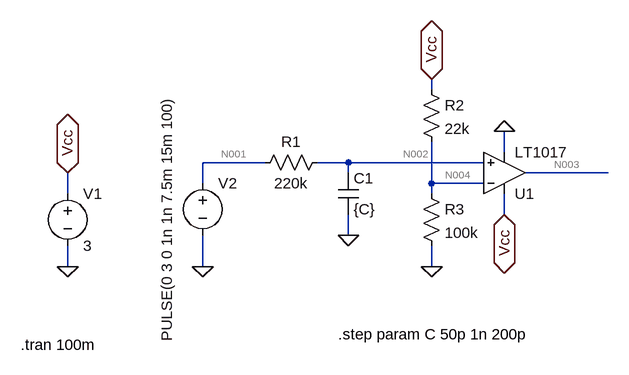
[diagram p0: schematic Draft1.asc]
Draft1.asc, the LTspice schematic file:
Version 4
SHEET 1 880 680
WIRE 352 64 352 48
WIRE 464 160 464 128
WIRE 96 176 0 176
WIRE 224 176 176 176
WIRE 432 176 224 176
WIRE 224 192 224 176
WIRE 624 192 496 192
WIRE 0 208 0 176
WIRE 352 208 352 144
WIRE 432 208 352 208
WIRE -208 224 -208 192
WIRE 352 224 352 208
WIRE 464 256 464 224
WIRE 224 288 224 256
WIRE -208 336 -208 304
WIRE 0 336 0 288
WIRE 352 336 352 304
FLAG 224 288 0
FLAG 352 336 0
FLAG -208 336 0
FLAG -208 192 Vcc
IOPIN -208 192 BiDir
FLAG 464 256 Vcc
IOPIN 464 256 BiDir
FLAG 464 128 0
FLAG 0 336 0
FLAG 352 48 Vcc
IOPIN 352 48 BiDir
SYMBOL res 192 160 R90
WINDOW 0 0 56 VBottom 2
WINDOW 3 32 56 VTop 2
SYMATTR InstName R1
SYMATTR Value 220k
SYMBOL cap 208 192 R0
SYMATTR InstName C1
SYMATTR Value {C}
SYMBOL res 336 48 R0
SYMATTR InstName R2
SYMATTR Value 22k
SYMBOL res 336 208 R0
SYMATTR InstName R3
SYMATTR Value 100k
SYMBOL voltage -208 208 R0
WINDOW 123 0 0 Left 2
WINDOW 39 0 0 Left 2
SYMATTR InstName V1
SYMATTR Value 3
SYMBOL voltage 0 192 R0
WINDOW 3 -55 -119 VRight 2
WINDOW 123 0 0 Left 2
WINDOW 39 0 0 Left 2
SYMATTR InstName V2
SYMATTR Value PULSE(0 3 0 1n 1n 7.5m 15m 100)
SYMBOL Comparators\\LT1017 464 192 M180
SYMATTR InstName U1
TEXT -280 456 Left 2 !.tran 100m
TEXT 208 440 Left 2 !.step param C 50p 1n 200p

The netlist it stands for:
* Draft1.asc
R1 N002 N001 220k
C1 N002 0 {C}
R2 Vcc N004 22k
R3 N004 0 100k
V1 Vcc 0 3
V2 N001 0 PULSE(0 3 0 1n 1n 7.5m 15m 100)
XU1 N002 N004 Vcc 0 N003 LT1017  ; pins In+ In- V+ V- OUT
.tran 100m
.step param C 50p 1n 200p
.backanno
.end

* Results of the author's LTspice run, read from the files saved beside the schematic
* Operating Point (first step), zero values left out:
*   c = 50 p
*   V(n002) = 660.5 µV
*   V(vcc) = 3 V
*   V(n004) = 2.459 V
*   V(n003) = 48.4 mV
*   I(R3) = 24.59 µA
*   I(R2) = 24.6 µA
*   I(R1) = 3.002 nA
*   I(V2) = 3.002 nA
*   I(V1) = -129.1 µA
*   Ix(u1:1) = -3.002 nA
*   Ix(u1:2) = 6.105 nA
*   Ix(u1:3) = 104.5 µA
*   Ix(u1:4) = -104.5 µA
*   Ix(u1:5) = 2.912 pA
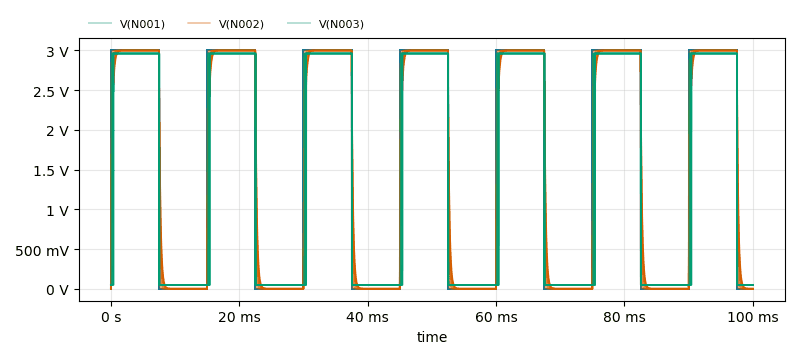
[diagram p1: Transient Analysis of Draft1.asc, plotted from the saved traces]
* Transient Analysis, 6 runs:
*   V(N001) [c=5e-011]: min 0 V, max 3 V, average 1.575 V, rms 2.174 V, last 0 V
*   V(N001) [c=2.5e-010]: min 0 V, max 3 V, average 1.575 V, rms 2.174 V, last 0 V
*   V(N001) [c=4.5e-010]: min 0 V, max 3 V, average 1.575 V, rms 2.174 V, last 0 V
*   V(N001) [c=6.5e-010]: min 0 V, max 3 V, average 1.575 V, rms 2.174 V, last 0 V
*   V(N001) [c=8.5e-010]: min 0 V, max 3 V, average 1.575 V, rms 2.174 V, last 0 V
*   V(N001) [c=1e-009]: min 0 V, max 3 V, average 1.575 V, rms 2.174 V, last 0 V
*   V(N002) [c=5e-011]: min 660.5 µV, max 2.999 V, average 1.575 V, rms 2.171 V, last 660.5 µV
*   V(N002) [c=2.5e-010]: min 660.5 µV, max 2.999 V, average 1.575 V, rms 2.165 V, last 660.5 µV
*   V(N002) [c=4.5e-010]: min 660.5 µV, max 2.999 V, average 1.574 V, rms 2.158 V, last 660.5 µV
*   V(N002) [c=6.5e-010]: min 660.5 µV, max 2.999 V, average 1.574 V, rms 2.152 V, last 660.6 µV
*   V(N002) [c=8.5e-010]: min 660.5 µV, max 2.999 V, average 1.574 V, rms 2.145 V, last 664.4 µV
*   V(N002) [c=1e-009]: min 660.5 µV, max 2.999 V, average 1.574 V, rms 2.14 V, last 690.9 µV
*   V(N003) [c=5e-011]: min 48.4 mV, max 2.96 V, average 1.571 V, rms 2.141 V, last 48.4 mV
*   V(N003) [c=2.5e-010]: min 48.4 mV, max 2.96 V, average 1.555 V, rms 2.13 V, last 48.4 mV
*   V(N003) [c=4.5e-010]: min 48.4 mV, max 2.96 V, average 1.54 V, rms 2.119 V, last 48.4 mV
*   V(N003) [c=6.5e-010]: min 48.4 mV, max 2.96 V, average 1.526 V, rms 2.109 V, last 48.4 mV
*   V(N003) [c=8.5e-010]: min 48.4 mV, max 2.96 V, average 1.511 V, rms 2.098 V, last 48.4 mV
*   V(N003) [c=1e-009]: min 48.4 mV, max 2.96 V, average 1.5 V, rms 2.09 V, last 48.4 mV